# Altium schematic sheet Current_Comparator.SchDoc
size A4; SheetNumber: 6; SheetTotal: 6
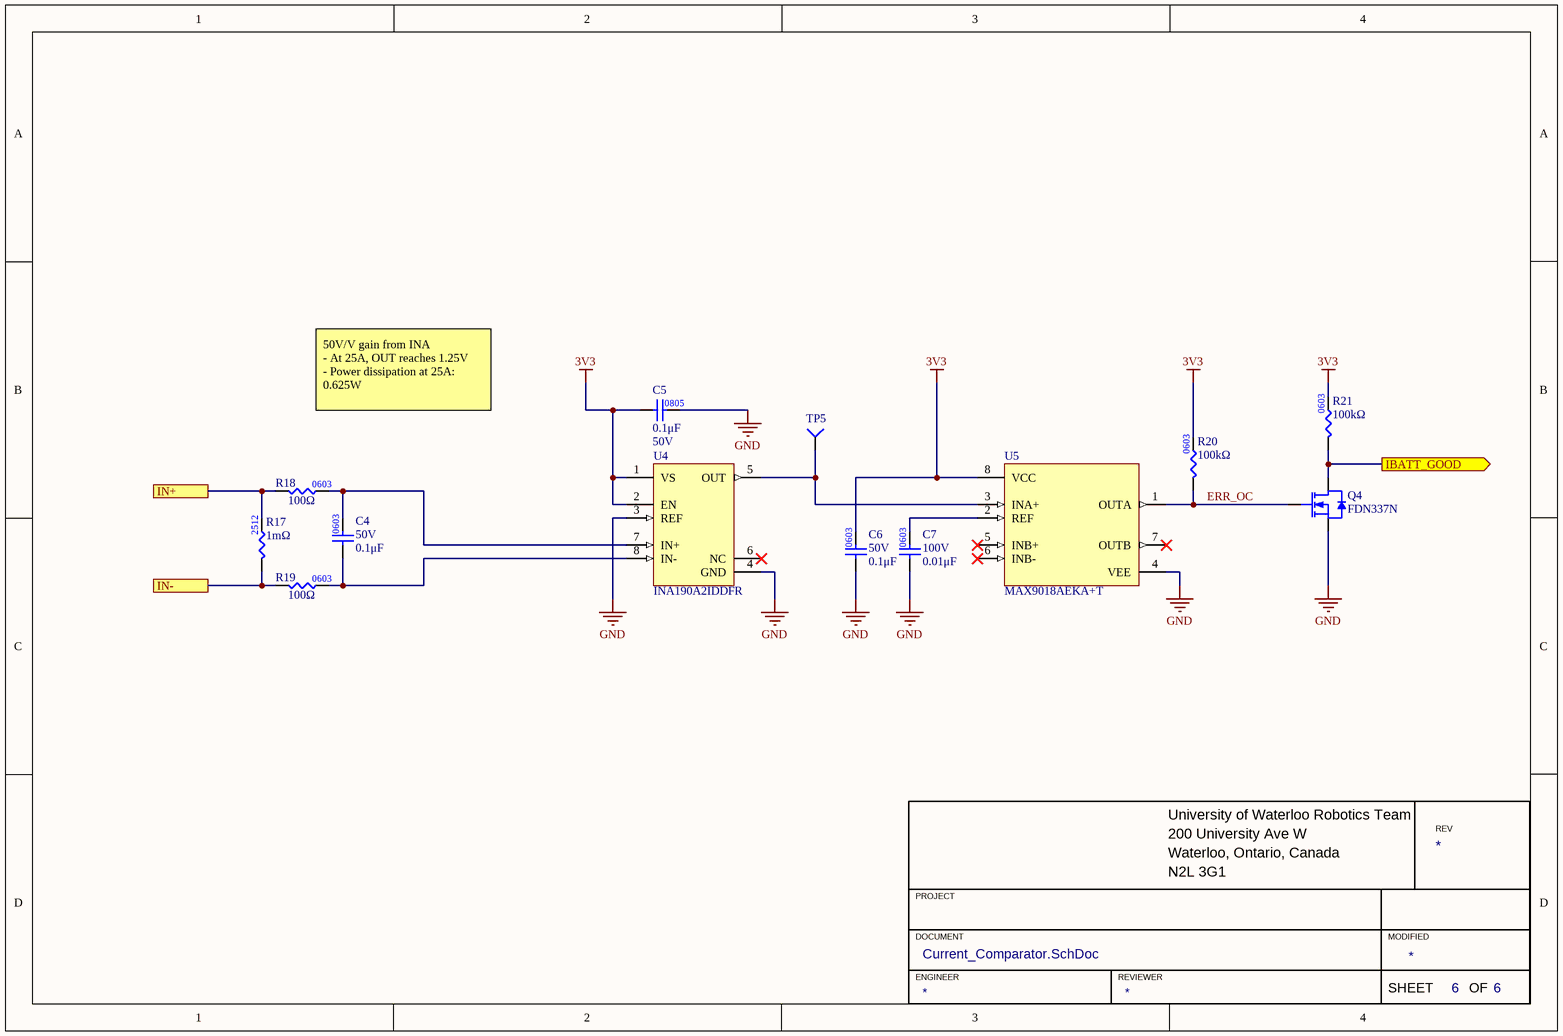
[diagram p0: Current_Comparator.SchDoc]

## Parts
C4  value 0.1μF  Voltage Rating: 50V  [CAP0603]  (hidden comment: CAP_0.1uF_50V_0603)
C5  value 0.1μF  Voltage Rating: 50V  [CAP0805]  (hidden comment: CAP_0.1uF_50V_0805)
C6  value 0.1μF  Voltage Rating: 50V  [CAP0603]  (hidden comment: CAP_0.1uF_50V_0603)
C7  value 0.01μF  Voltage Rating: 100V  [CAP0603]  (hidden comment: CAP_0.01uF_100V_0603)
Q4  Manufacturer Part Number 1: FDN337N  [NMOS_SSOT-3]  (hidden comment: NMOS_30V_2.2A)
R17  value 1mΩ  [RESC6532X75N]  (hidden comment: RES_1mΩ_2512_1%)
R18  value 100Ω  [RES0603]  (hidden comment: RES_100Ω_0603_1%)
R19  value 100Ω  [RES0603]  (hidden comment: RES_100Ω_0603_1%)
R20  value 100kΩ  [RES0603]  (hidden comment: RES_100kΩ_0603_1%)
R21  value 100kΩ  [RES0603]  (hidden comment: RES_100kΩ_0603_1%)
TP5  TESTPOINT_1MM_CIRCLE  [TESTPOINT_CIRCLE_1MM]  (value not drawn)  (no BOM)
U4  INA190A2IDDFR  [SOT23-8 TI]
U5  Manufacturer Part Number 1: MAX9018AEKA+T  [SOT23-8 MAXIM]  (hidden comment: IC_COMPARATOR_MAX9018)

## Ports
IBATT_GOOD (out), IN+, IN-

## Nets
3V3: C5.1 C6.2 R20.2 R21.2 U4.1(VS) U4.2(EN) U5.8(VCC)
GND: C5.2 C6.1 C7.1 Q4.2(SOURCE) U4.3(REF) U4.4(GND) U5.4(VEE)
ERR_OC: Q4.1(GATE) R20.1 U5.1(OUTA)
IBATT_GOOD: Q4.3(DRAIN) R21.1 ; port IBATT_GOOD
IN+: R17.2 R18.1 ; port IN+
IN-: R17.1 R19.1 ; port IN-
NetC4_1: C4.1 R19.2 U4.8(IN-)
NetC4_2: C4.2 R18.2 U4.7(IN+)
NetC7_2: C7.2 U5.2(REF)
NetTP5_1: TP5.1(=value) U4.5(OUT) U5.3(INA+)

Not connected (* = marked no-connect by the designer): U4 6(NC)*; U5 5(INB+)* 6(INB-)* 7(OUTB)*

## Notes on the sheet
- 50V/V gain from INA
  - At 25A, OUT reaches 1.25V
  - Power dissipation at 25A: 0.625W
- University of Waterloo Robotics Team
- 200 University Ave W
- REV
- PROJECT
- Waterloo, Ontario, Canada
- N2L 3G1
- DOCUMENT
- ENGINEER
- REVIEWER
- MODIFIED
- SHEET
- OF
- (in symbol CAP_0.01uF_100V_0603) 0603
- (in symbol RES_100kΩ_0603_1%) 0603
- (in symbol RES_100Ω_0603_1%) 0603

## Library data of the parts
C4 C6 = CAP_0.1uF_50V_0603: CAP CER 0.1UF 50V X7R 0603; Manufacturer Part Number 1: CC0603KRX7R9BB104; Manufacturer 1: Yageo; Package/Footprint: 0603; Supplier Part Number 1: 311-1344-1-ND; Supplier 1: Digi-Key; Mounting Type: SMD; Dielectric: X7R
C5 = CAP_0.1uF_50V_0805: CAP CER 0.1UF 50V X7R 0805; Manufacturer 1: Murata Electronics; Manufacturer Part Number 1: GCM21BR71H104KA37K; Package/Footprint: 0805; Supplier 1: Digi-Key; Supplier Part Number 1: 490-8049-1-ND; Mounting Type: SMD; Dielectric: X7R; LCSC Part #: C49678
C7 = CAP_0.01uF_100V_0603: CAP CER 0.01uF 100V X7R 0603; Manufacturer Part Number 1: GCM188R72A103KA37J; Manufacturer 1: Murata Electronics; Supplier Part Number 1: 490-8028-1-ND; Supplier 1: Digi-Key; Dielectric: X7R
Q4 = NMOS_30V_2.2A: MOSFET N-CH 30V 2.2A SUPERSOT3; Manufacturer 1: ON Semiconductor / Fairchild; Vgs (Max): ±8V; Supplier 1: Digi-Key; Mounting Type: SMD; Package: SuperSOT-3; Supplier Part Number 1: FDN337NCT-ND; Id: 2.2A; Vdss: 30V; Verified: No
R17 = RES_1mΩ_2512_1%: RES 1 mOHM 1% 3W 2512; Manufacturer 1: Riedon; Manufacturer Part Number 1: CSRL3-0R001F8; Supplier 1: Digi-Key; Supplier Part Number 1: 696-1834-1-ND; Mounting Type: SMD; Package: 2512
R18 R19 = RES_100Ω_0603_1%: RES 100 OHM 1% 1/10W 0603; Manufacturer 1: Yageo; Manufacturer Part Number 1: RC0603FR-07100RL; Supplier Part Number 1: 311-100HRCT-ND; Supplier 1: Digi-Key
R20 R21 = RES_100kΩ_0603_1%: RES 100K OHM 1% 1/10W 0603; Manufacturer 1: Yageo; Manufacturer Part Number 1: RC0603FR-07100KL; Supplier Part Number 1: 311-100KHRCT-ND; Supplier 1: Digi-Key
TP5 = TESTPOINT_1MM_CIRCLE: TESTPOINT 1MM CIRCLE
U4 = INA190A2IDDFR: IC CURR SENSE 1 CIRCUIT SOT23-8; Manufacturer 1: Texas Instruments; Supplier 1: Digi-Key; Supplier Part Number 1: 296-INA190A2IDDFRCT-ND; Package/Footprint: SOT23-8; Manufacturer Part Number 1: INA190A2IDDFR
U5 = IC_COMPARATOR_MAX9018: IC COMPARATOR DUAL SOT23-8; Manufacturer 1: Analog Devices Inc./Maxim Integrated; Package/Footprint: SOT-23-8; Mounting Type: SMD; Supplier 1: Digi-Key; Supplier Part Number 1: MAX9018AEKA+TCT-ND